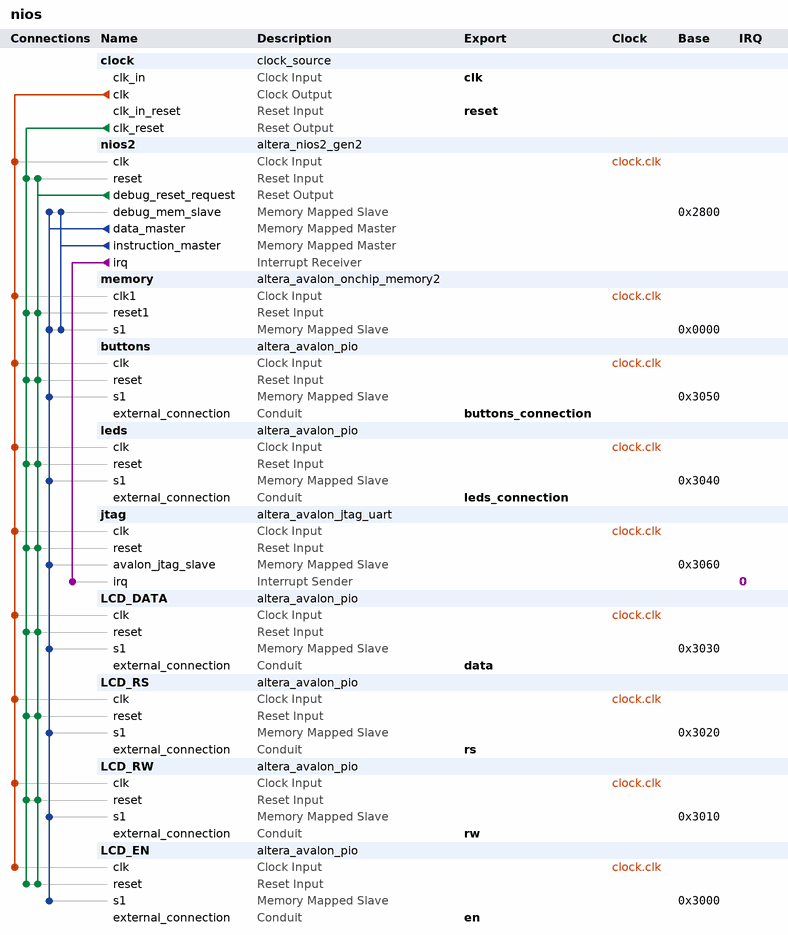
[diagram p0: system contents]
# Platform Designer (Qsys) system nios, Cyclone IV E EP4CE6E22C8
# Parameters at their usual value, and those the tool derives, are not listed.
package require -exact qsys 18.1
create_system nios
set_project_property DEVICE_FAMILY {Cyclone IV E}
set_project_property DEVICE EP4CE6E22C8

add_instance clock clock_source 18.1
set_instance_parameter_value clock clockFrequency 50000000

add_instance nios2 altera_nios2_gen2 18.1
set_instance_parameter_value nios2 dcache_size 2048
set_instance_parameter_value nios2 exceptionSlave memory.s1
set_instance_parameter_value nios2 icache_size 4096
set_instance_parameter_value nios2 impl Tiny
set_instance_parameter_value nios2 resetSlave memory.s1
set_instance_parameter_value nios2 setting_activateTrace true

add_instance memory altera_avalon_onchip_memory2 18.1
set_instance_parameter_value memory dataWidth 32
set_instance_parameter_value memory dualPort false
set_instance_parameter_value memory initMemContent true
set_instance_parameter_value memory initializationFileName onchip_mem.hex
set_instance_parameter_value memory memorySize 8192

add_instance buttons altera_avalon_pio 18.1
set_instance_parameter_value buttons direction Input
set_instance_parameter_value buttons width 4

add_instance leds altera_avalon_pio 18.1
set_instance_parameter_value leds direction Output
set_instance_parameter_value leds width 5

add_instance jtag altera_avalon_jtag_uart 18.1
set_instance_parameter_value jtag simInteractiveOptions NO_INTERACTIVE_WINDOWS

add_instance LCD_DATA altera_avalon_pio 18.1
set_instance_parameter_value LCD_DATA direction Output
set_instance_parameter_value LCD_DATA width 8

add_instance LCD_RS altera_avalon_pio 18.1
set_instance_parameter_value LCD_RS direction Output
set_instance_parameter_value LCD_RS width 1

add_instance LCD_RW altera_avalon_pio 18.1
set_instance_parameter_value LCD_RW direction Output
set_instance_parameter_value LCD_RW width 1

add_instance LCD_EN altera_avalon_pio 18.1
set_instance_parameter_value LCD_EN direction Output
set_instance_parameter_value LCD_EN width 1

# connections
add_connection clock.clk buttons.clk clock
add_connection clock.clk jtag.clk clock
add_connection clock.clk LCD_DATA.clk clock
add_connection clock.clk LCD_EN.clk clock
add_connection clock.clk LCD_RS.clk clock
add_connection clock.clk LCD_RW.clk clock
add_connection clock.clk leds.clk clock
add_connection clock.clk memory.clk1 clock
add_connection clock.clk nios2.clk clock
add_connection clock.clk_reset buttons.reset reset
add_connection clock.clk_reset jtag.reset reset
add_connection clock.clk_reset LCD_DATA.reset reset
add_connection clock.clk_reset LCD_EN.reset reset
add_connection clock.clk_reset LCD_RS.reset reset
add_connection clock.clk_reset LCD_RW.reset reset
add_connection clock.clk_reset leds.reset reset
add_connection clock.clk_reset memory.reset1 reset
add_connection clock.clk_reset nios2.reset reset
add_connection nios2.debug_reset_request buttons.reset reset
add_connection nios2.debug_reset_request jtag.reset reset
add_connection nios2.debug_reset_request LCD_DATA.reset reset
add_connection nios2.debug_reset_request LCD_EN.reset reset
add_connection nios2.debug_reset_request LCD_RS.reset reset
add_connection nios2.debug_reset_request LCD_RW.reset reset
add_connection nios2.debug_reset_request leds.reset reset
add_connection nios2.debug_reset_request memory.reset1 reset
add_connection nios2.debug_reset_request nios2.reset reset
add_connection nios2.data_master buttons.s1 avalon
set_connection_parameter_value nios2.data_master/buttons.s1 baseAddress 0x3050
add_connection nios2.data_master jtag.avalon_jtag_slave avalon
set_connection_parameter_value nios2.data_master/jtag.avalon_jtag_slave baseAddress 0x3060
add_connection nios2.data_master LCD_DATA.s1 avalon
set_connection_parameter_value nios2.data_master/LCD_DATA.s1 baseAddress 0x3030
add_connection nios2.data_master LCD_EN.s1 avalon
set_connection_parameter_value nios2.data_master/LCD_EN.s1 baseAddress 0x3000
add_connection nios2.data_master LCD_RS.s1 avalon
set_connection_parameter_value nios2.data_master/LCD_RS.s1 baseAddress 0x3020
add_connection nios2.data_master LCD_RW.s1 avalon
set_connection_parameter_value nios2.data_master/LCD_RW.s1 baseAddress 0x3010
add_connection nios2.data_master leds.s1 avalon
set_connection_parameter_value nios2.data_master/leds.s1 baseAddress 0x3040
add_connection nios2.data_master memory.s1 avalon
set_connection_parameter_value nios2.data_master/memory.s1 baseAddress 0x0000
add_connection nios2.data_master nios2.debug_mem_slave avalon
set_connection_parameter_value nios2.data_master/nios2.debug_mem_slave baseAddress 0x2800
add_connection nios2.instruction_master memory.s1 avalon
set_connection_parameter_value nios2.instruction_master/memory.s1 baseAddress 0x0000
add_connection nios2.instruction_master nios2.debug_mem_slave avalon
set_connection_parameter_value nios2.instruction_master/nios2.debug_mem_slave baseAddress 0x2800
add_connection nios2.irq jtag.irq interrupt
set_connection_parameter_value nios2.irq/jtag.irq irqNumber 0

# exported interfaces
add_interface buttons_connection conduit end
set_interface_property buttons_connection EXPORT_OF buttons.external_connection
add_interface clk clock sink
set_interface_property clk EXPORT_OF clock.clk_in
add_interface data conduit end
set_interface_property data EXPORT_OF LCD_DATA.external_connection
add_interface en conduit end
set_interface_property en EXPORT_OF LCD_EN.external_connection
add_interface leds_connection conduit end
set_interface_property leds_connection EXPORT_OF leds.external_connection
add_interface reset reset sink
set_interface_property reset EXPORT_OF clock.clk_in_reset
add_interface rs conduit end
set_interface_property rs EXPORT_OF LCD_RS.external_connection
add_interface rw conduit end
set_interface_property rw EXPORT_OF LCD_RW.external_connection

set_interconnect_requirement {$system} qsys_mm.clockCrossingAdapter HANDSHAKE
set_interconnect_requirement {$system} qsys_mm.insertDefaultSlave false
set_interconnect_requirement {$system} qsys_mm.maxAdditionalLatency 1

save_system nios.qsys
